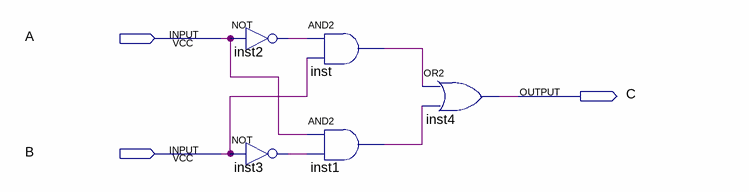
[diagram p0: schematic sheet]
// Quartus schematic Gate1.bdf as structural Verilog: 5 symbols, 3 pins
module Gate1 (
  input  A,
  input  B,
  output C
);

  wire inst1_out, inst2_out, inst3_out, inst_out;

  not inst2 (inst2_out, A);
  not inst3 (inst3_out, B);
  and inst (inst_out, inst2_out, B);
  and inst1 (inst1_out, A, inst3_out);
  or inst4 (C, inst_out, inst1_out);
endmodule
